# EasyEDA schematic SCH_分压定理 copy_2024-03-07.json
TITLE: Sheet_1; REV: 1.0; Date: 2022-11-10; Sheet: 1/1; Company: Your Company
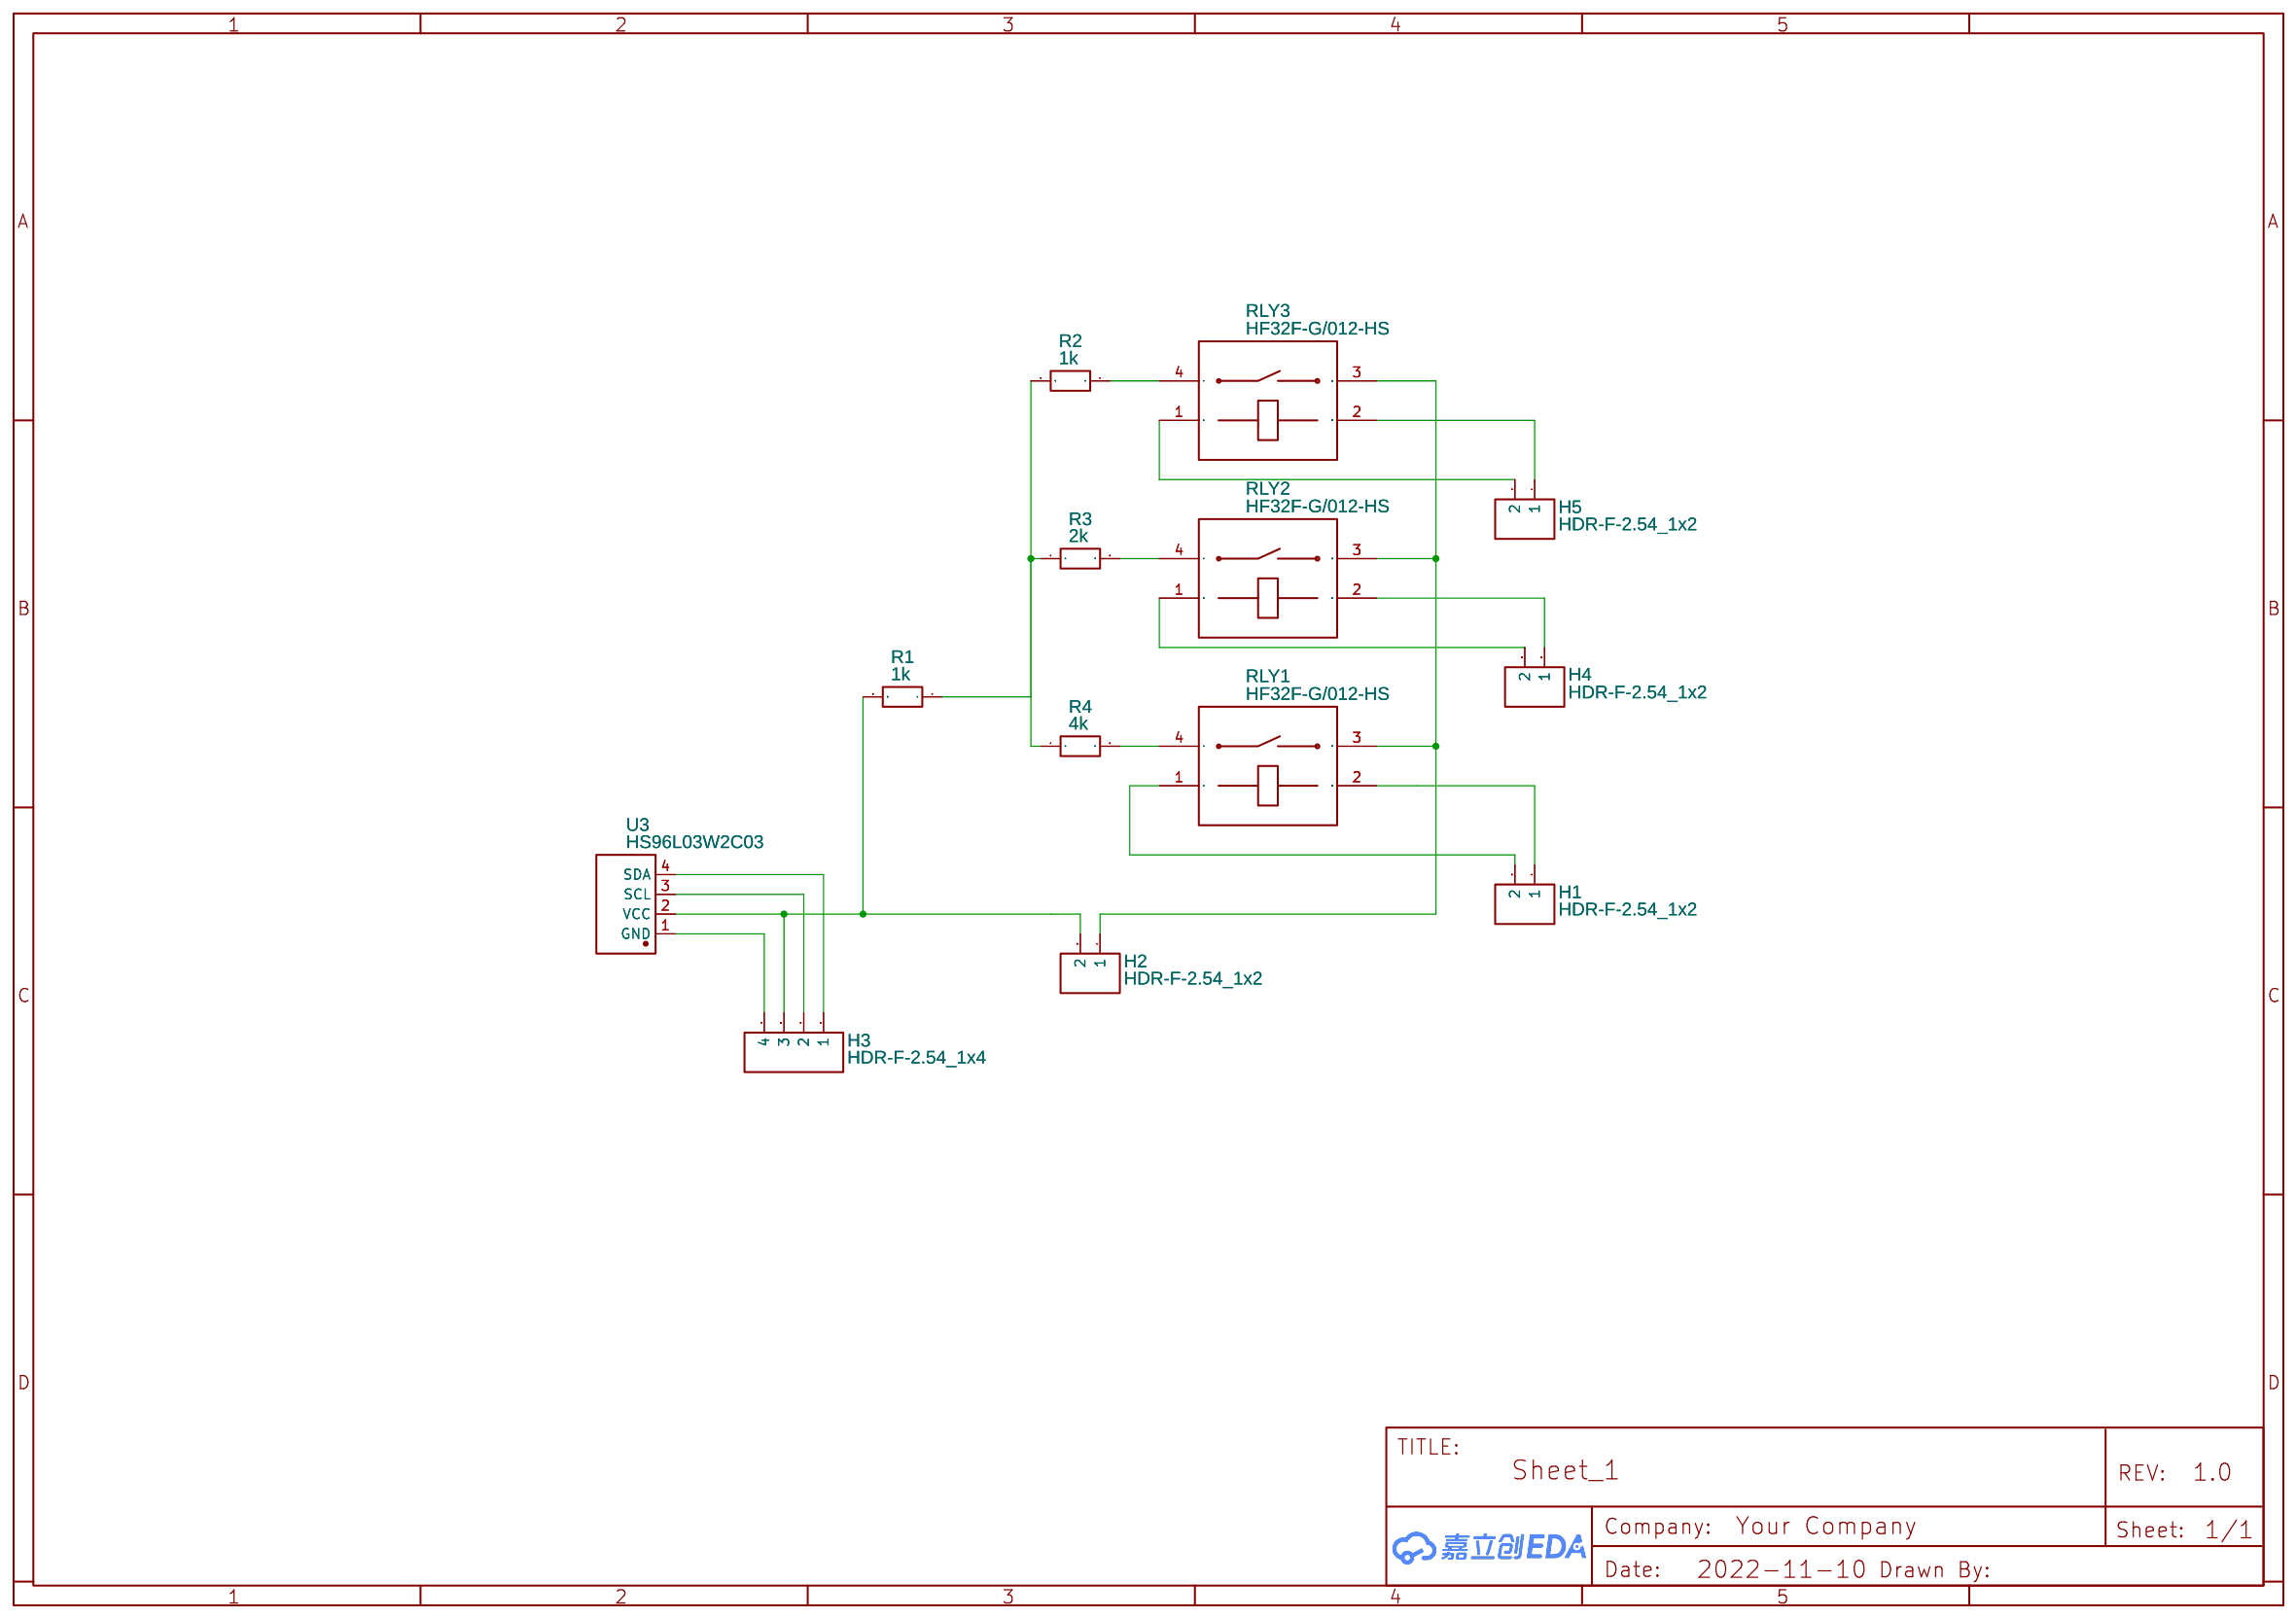
[diagram p0: schematic sheet]

## Parts
H1  HDR-F-2.54_1x2  [HDR-F-2.54_1X2]
H2  HDR-F-2.54_1x2  [HDR-F-2.54_1X2]
H3  HDR-F-2.54_1x4  [HDR-F-2.54_1X4]
H4  HDR-F-2.54_1x2  [HDR-F-2.54_1X2]
H5  HDR-F-2.54_1x2  [HDR-F-2.54_1X2]
R1  1k  [R_AXIAL-0.3]
R2  1k  [R_AXIAL-0.3]
R3  2k  [R0603]
R4  4k  [R0603]
RLY1  HF32F-G/012-HS  [RELAY-TH_HF32F-X-HXXXX-XXX]
RLY2  HF32F-G/012-HS  [RELAY-TH_HF32F-X-HXXXX-XXX]
RLY3  HF32F-G/012-HS  [RELAY-TH_HF32F-X-HXXXX-XXX]
U3  HS96L03W2C03  [OLED-TH_L27.8-W27.2-P2.54_C9900033791]

## Library data of the parts
H1 H2 H4 H5 = HDR-F-2.54_1x2: Supplier Part: C49661; Supplier: LCSC; Contributor: LCEDA_Lib
H3 = HDR-F-2.54_1x4: Supplier Part: C225501; Supplier: LCSC; Contributor: LCEDA_Lib
R1 R2 = R_AXIAL-0.3_EU: Contributor: LCEDA_Lib
R3 R4 = R_0603_EU: Contributor: LCEDA_Lib
RLY1-RLY3 = HF32F-G/012-HS: Supplier: LCSC; Manufacturer: HF(宏发); Supplier Part: C53562; JLCPCB Part Class: Extended Part
U3 = HS96L03W2C03: Supplier: LCSC; Supplier Part: C5248080; Manufacturer: HS(汉昇); JLCPCB Part Class: Extended Part; Contributor: lcsc

## Nets
Net-(H1-1): H1.1 RLY1.2
Net-(H1-2): H1.2 RLY1.1
Net-(H2-1): H2.1 RLY1.3 RLY2.3 RLY3.3
Net-(H2-2): H2.2 H3.3 R1.2 U3.2(VCC)
Net-(H3-1): H3.1 U3.4(SDA)
Net-(H3-2): H3.2 U3.3(SCL)
Net-(H3-4): H3.4 U3.1(GND)
Net-(H4-1): H4.1 RLY2.2
Net-(H4-2): H4.2 RLY2.1
Net-(H5-1): H5.1 RLY3.2
Net-(H5-2): H5.2 RLY3.1
Net-(R1-1): R1.1 R2.2 R3.1 R4.1
Net-(R2-1): R2.1 RLY3.4
Net-(R3-2): R3.2 RLY2.4
Net-(R4-2): R4.2 RLY1.4
